# EAGLE design Board Jam v2 (EAGLE 6.6.0)
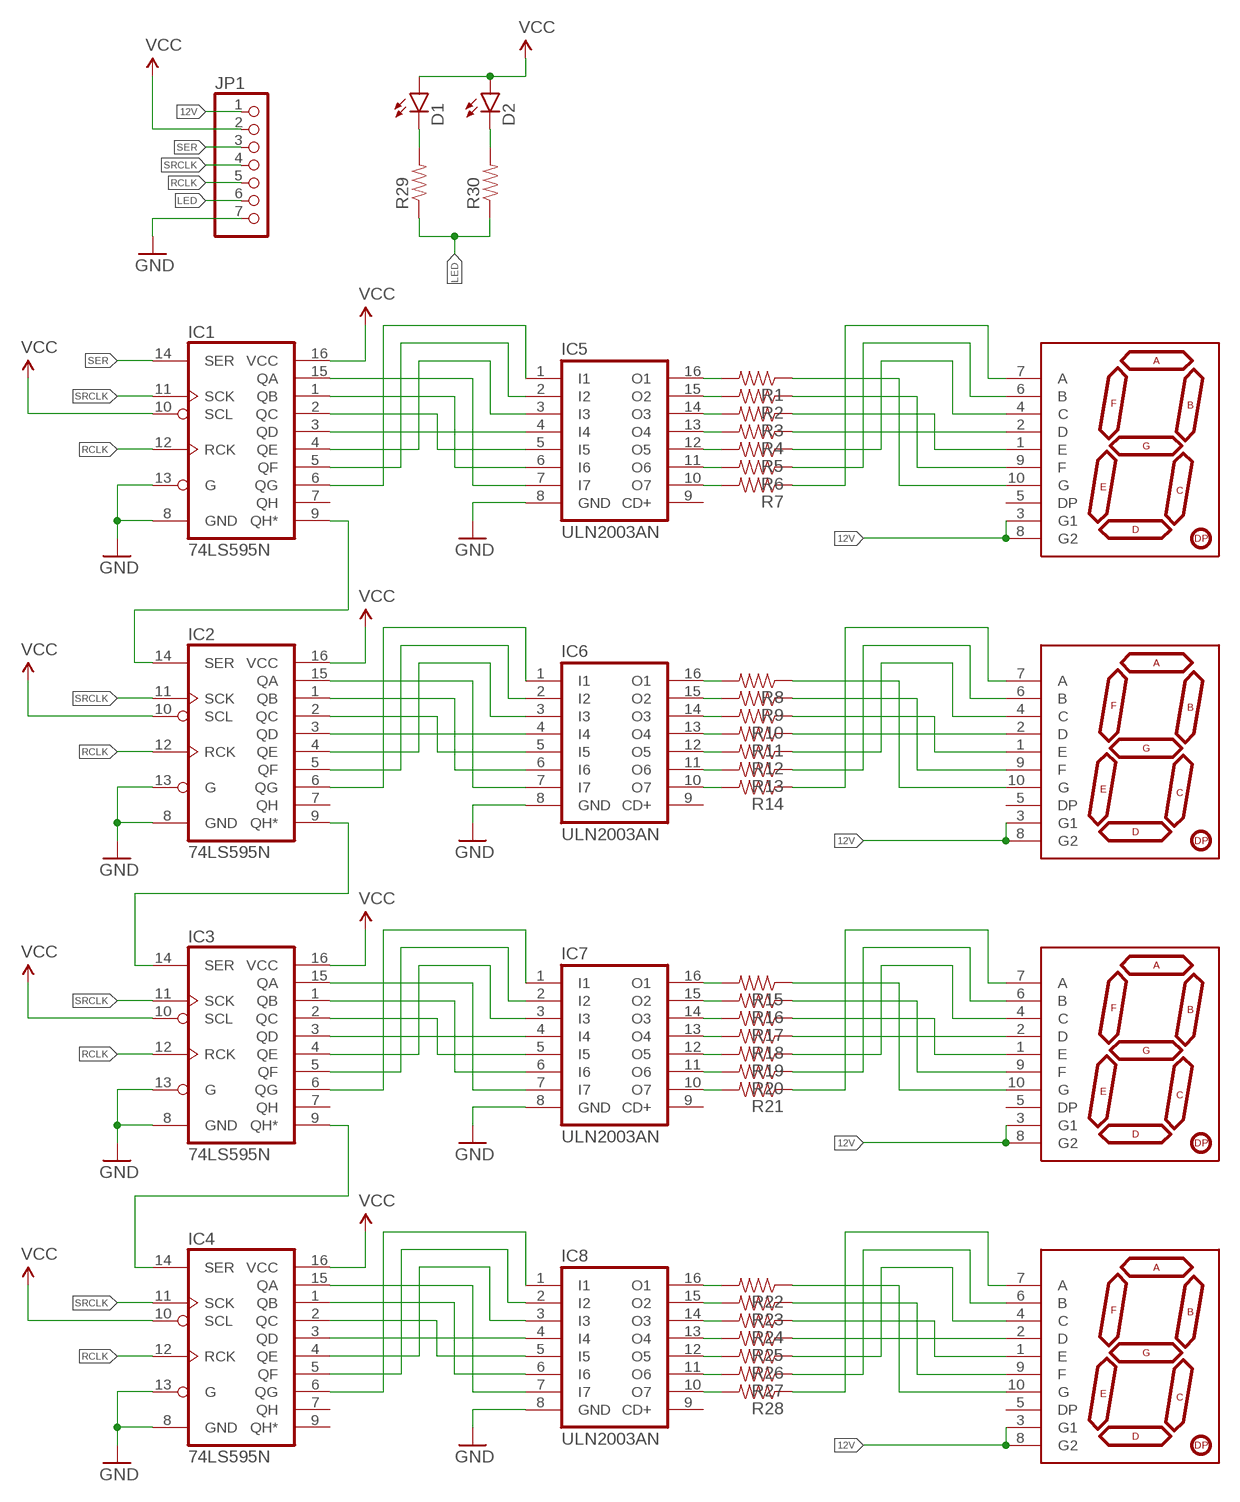
[diagram p0: schematic, sheet 1]

## Parts
D1  LED5MM  [LED5MM]
D2  LED5MM  [LED5MM]
IC1  74LS595N  [DIL16]
IC2  74LS595N  [DIL16]
IC3  74LS595N  [DIL16]
IC4  74LS595N  [DIL16]
IC5  ULN2003AN  [DIL16]
IC6  ULN2003AN  [DIL16]
IC7  ULN2003AN  [DIL16]
IC8  ULN2003AN  [DIL16]
JP1  PINHD-1X7  [1X07]
R1  RESISTORPTH-1/4W  [AXIAL-0.4]
R2  RESISTORPTH-1/4W  [AXIAL-0.4]
R3  RESISTORPTH-1/4W  [AXIAL-0.4]
R4  RESISTORPTH-1/4W  [AXIAL-0.4]
R5  RESISTORPTH-1/4W  [AXIAL-0.4]
R6  RESISTORPTH-1/4W  [AXIAL-0.4]
R7  RESISTORPTH-1/4W  [AXIAL-0.4]
R8  RESISTORPTH-1/4W  [AXIAL-0.4]
R9  RESISTORPTH-1/4W  [AXIAL-0.4]
R10  RESISTORPTH-1/4W  [AXIAL-0.4]
R11  RESISTORPTH-1/4W  [AXIAL-0.4]
R12  RESISTORPTH-1/4W  [AXIAL-0.4]
R13  RESISTORPTH-1/4W  [AXIAL-0.4]
R14  RESISTORPTH-1/4W  [AXIAL-0.4]
R15  RESISTORPTH-1/4W  [AXIAL-0.4]
R16  RESISTORPTH-1/4W  [AXIAL-0.4]
R17  RESISTORPTH-1/4W  [AXIAL-0.4]
R18  RESISTORPTH-1/4W  [AXIAL-0.4]
R19  RESISTORPTH-1/4W  [AXIAL-0.4]
R20  RESISTORPTH-1/4W  [AXIAL-0.4]
R21  RESISTORPTH-1/4W  [AXIAL-0.4]
R22  RESISTORPTH-1/4W  [AXIAL-0.4]
R23  RESISTORPTH-1/4W  [AXIAL-0.4]
R24  RESISTORPTH-1/4W  [AXIAL-0.4]
R25  RESISTORPTH-1/4W  [AXIAL-0.4]
R26  RESISTORPTH-1/4W  [AXIAL-0.4]
R27  RESISTORPTH-1/4W  [AXIAL-0.4]
R28  RESISTORPTH-1/4W  [AXIAL-0.4]
R29  RESISTORPTH-1/4W  [AXIAL-0.4]
R30  RESISTORPTH-1/4W  [AXIAL-0.4]
U$1  7-SEGMENT-DISPLAY-1"-RED7-SEGMENT-1.8"PTH  [7-SEGMENT-1"PTH]
U$2  7-SEGMENT-DISPLAY-1"-RED7-SEGMENT-1.8"PTH  [7-SEGMENT-1"PTH]
U$3  7-SEGMENT-DISPLAY-1"-RED7-SEGMENT-1.8"PTH  [7-SEGMENT-1"PTH]
U$4  7-SEGMENT-DISPLAY-1"-RED7-SEGMENT-1.8"PTH  [7-SEGMENT-1"PTH]

## Nets
12V: JP1.1 U$1.3(G1) U$1.8(G2) U$2.3(G1) U$2.8(G2) U$3.3(G1) U$3.8(G2) U$4.3(G1) U$4.8(G2)
GND: IC1.8(GND) IC1.13(G) IC2.8(GND) IC2.13(G) IC3.8(GND) IC3.13(G) IC4.8(GND) IC4.13(G) IC5.8(GND) IC6.8(GND) IC7.8(GND) IC8.8(GND) JP1.7
LED: JP1.6 R29.P$1 R30.P$1
N$1: IC1.15(QA) IC5.7(I7)
N$2: IC2.15(QA) IC6.7(I7)
N$3: IC1.1(QB) IC5.6(I6)
N$4: IC1.2(QC) IC5.5(I5)
N$5: IC1.3(QD) IC5.4(I4)
N$6: IC1.4(QE) IC5.3(I3)
N$7: IC1.5(QF) IC5.2(I2)
N$8: IC1.6(QG) IC5.1(I1)
N$9: IC2.1(QB) IC6.6(I6)
N$10: IC2.2(QC) IC6.5(I5)
N$11: IC2.3(QD) IC6.4(I4)
N$12: IC2.4(QE) IC6.3(I3)
N$13: IC2.5(QF) IC6.2(I2)
N$14: IC2.6(QG) IC6.1(I1)
N$15: IC6.16(O1) R8.P$2
N$16: IC6.15(O2) R9.P$2
N$17: IC6.14(O3) R10.P$2
N$18: IC6.13(O4) R11.P$2
N$19: IC6.12(O5) R12.P$2
N$20: IC6.11(O6) R13.P$2
N$21: IC6.10(O7) R14.P$2
N$22: IC3.15(QA) IC7.7(I7)
N$23: IC3.1(QB) IC7.6(I6)
N$24: IC3.2(QC) IC7.5(I5)
N$25: IC3.3(QD) IC7.4(I4)
N$26: IC3.4(QE) IC7.3(I3)
N$27: IC3.5(QF) IC7.2(I2)
N$28: IC3.6(QG) IC7.1(I1)
N$29: IC1.9(QH*) IC2.14(SER)
N$30: IC2.9(QH*) IC3.14(SER)
N$31: IC3.9(QH*) IC4.14(SER)
N$32: D1.K(C) R29.P$2
N$33: D2.K(C) R30.P$2
N$34: IC7.16(O1) R15.P$2
N$35: IC5.16(O1) R1.P$2
N$36: IC5.15(O2) R2.P$2
N$37: IC5.14(O3) R3.P$2
N$38: IC5.13(O4) R4.P$2
N$39: IC5.12(O5) R5.P$2
N$40: IC5.11(O6) R6.P$2
N$41: IC5.10(O7) R7.P$2
N$42: IC7.15(O2) R16.P$2
N$43: IC7.14(O3) R17.P$2
N$44: IC7.13(O4) R18.P$2
N$45: IC7.12(O5) R19.P$2
N$46: IC7.11(O6) R20.P$2
N$47: IC7.10(O7) R21.P$2
N$48: IC4.15(QA) IC8.7(I7)
N$49: IC4.1(QB) IC8.6(I6)
N$50: IC4.2(QC) IC8.5(I5)
N$51: IC4.3(QD) IC8.4(I4)
N$52: IC4.4(QE) IC8.3(I3)
N$53: IC4.5(QF) IC8.2(I2)
N$54: IC4.6(QG) IC8.1(I1)
N$55: IC8.16(O1) R22.P$2
N$56: IC8.15(O2) R23.P$2
N$57: IC8.14(O3) R24.P$2
N$58: IC8.13(O4) R25.P$2
N$59: IC8.12(O5) R26.P$2
N$60: IC8.11(O6) R27.P$2
N$61: IC8.10(O7) R28.P$2
N$62: R1.P$1 U$1.10(G)
N$63: R2.P$1 U$1.9(F)
N$64: R3.P$1 U$1.1(E)
N$65: R4.P$1 U$1.2(D)
N$66: R5.P$1 U$1.4(C)
N$67: R6.P$1 U$1.6(B)
N$68: R7.P$1 U$1.7(A)
N$69: R8.P$1 U$2.10(G)
N$70: R9.P$1 U$2.9(F)
N$71: R10.P$1 U$2.1(E)
N$72: R11.P$1 U$2.2(D)
N$73: R12.P$1 U$2.4(C)
N$74: R13.P$1 U$2.6(B)
N$75: R14.P$1 U$2.7(A)
N$76: R15.P$1 U$3.10(G)
N$77: R16.P$1 U$3.9(F)
N$78: R17.P$1 U$3.1(E)
N$79: R18.P$1 U$3.2(D)
N$80: R19.P$1 U$3.4(C)
N$81: R20.P$1 U$3.6(B)
N$82: R21.P$1 U$3.7(A)
N$83: R22.P$1 U$4.10(G)
N$84: R23.P$1 U$4.9(F)
N$85: R24.P$1 U$4.1(E)
N$86: R25.P$1 U$4.2(D)
N$87: R26.P$1 U$4.4(C)
N$88: R27.P$1 U$4.6(B)
N$89: R28.P$1 U$4.7(A)
RCLK: IC1.12(RCK) IC2.12(RCK) IC3.12(RCK) IC4.12(RCK) JP1.5
SER: IC1.14(SER) JP1.3
SRCLK: IC1.11(SCK) IC2.11(SCK) IC3.11(SCK) IC4.11(SCK) JP1.4
VCC: D1.A D2.A IC1.10(SCL) IC1.16(VCC) IC2.10(SCL) IC2.16(VCC) IC3.10(SCL) IC3.16(VCC) IC4.10(SCL) IC4.16(VCC) JP1.2
Unconnected: IC1.7(QH) IC2.7(QH) IC3.7(QH) IC4.7(QH) IC4.9(QH*) IC5.9(CD+) IC6.9(CD+) IC7.9(CD+) IC8.9(CD+) U$1.5(DP) U$2.5(DP) U$3.5(DP) U$4.5(DP)

## Library data of the parts
D1 D2 = SparkFun-LED:LED: LEDs Standard schematic elements and footprints for 5mm, 3mm, 1206, and 0603 sized LEDs. 5mm - Spark Fun Electronics SKU : COM-00529 (and others)
IC1-IC4 = SparkFun-DigitalIC:74*595: 8-bit SHIFT REGISTER, output latch
IC5-IC8 = uln-udn:ULN2003A: DRIVER ARRAY
JP1 = pinhead:PINHD-1X7: PIN HEADER
R1-R30 = SparkFun-Passives:RESISTOR: Resistor Basic schematic elements and footprints for 0603, 1206, and PTH resistors.
U$1-U$4 = yogaLibrary:7-SEGMENT-DISPLAY-1"-RED: 7-Segment Display 1" Red (COM-08546) EZ is for kits. Pads are only exposed on the bottom side to help prevent soldering in upside down.

## Board
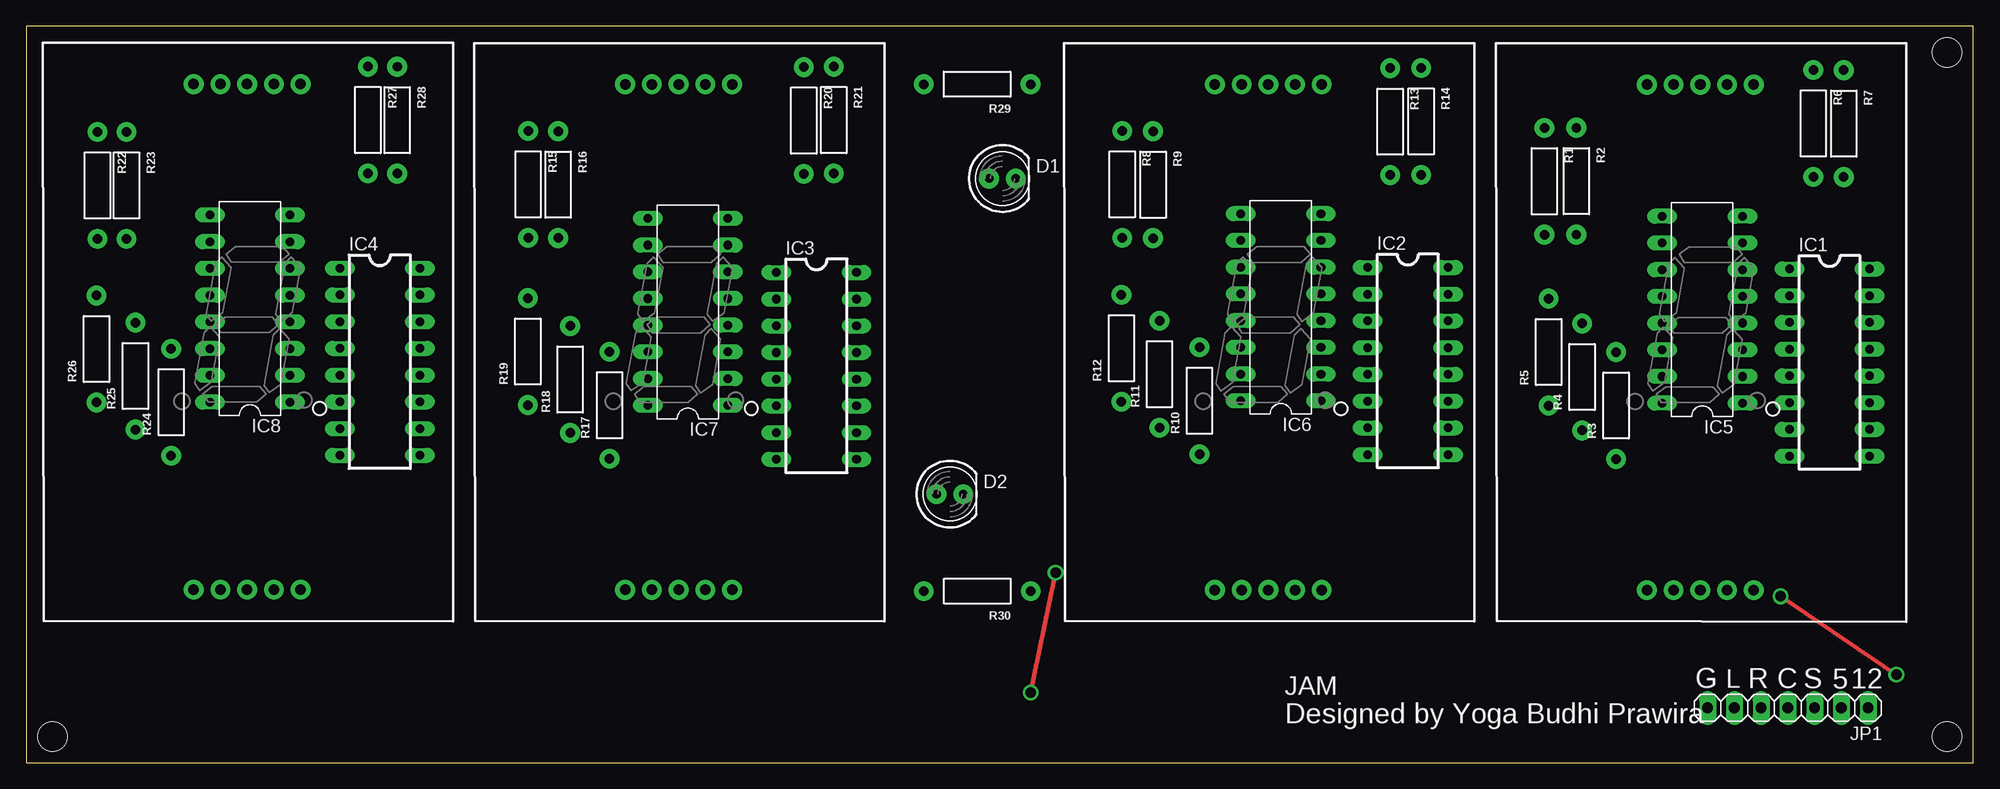
[diagram p1: board, top side]
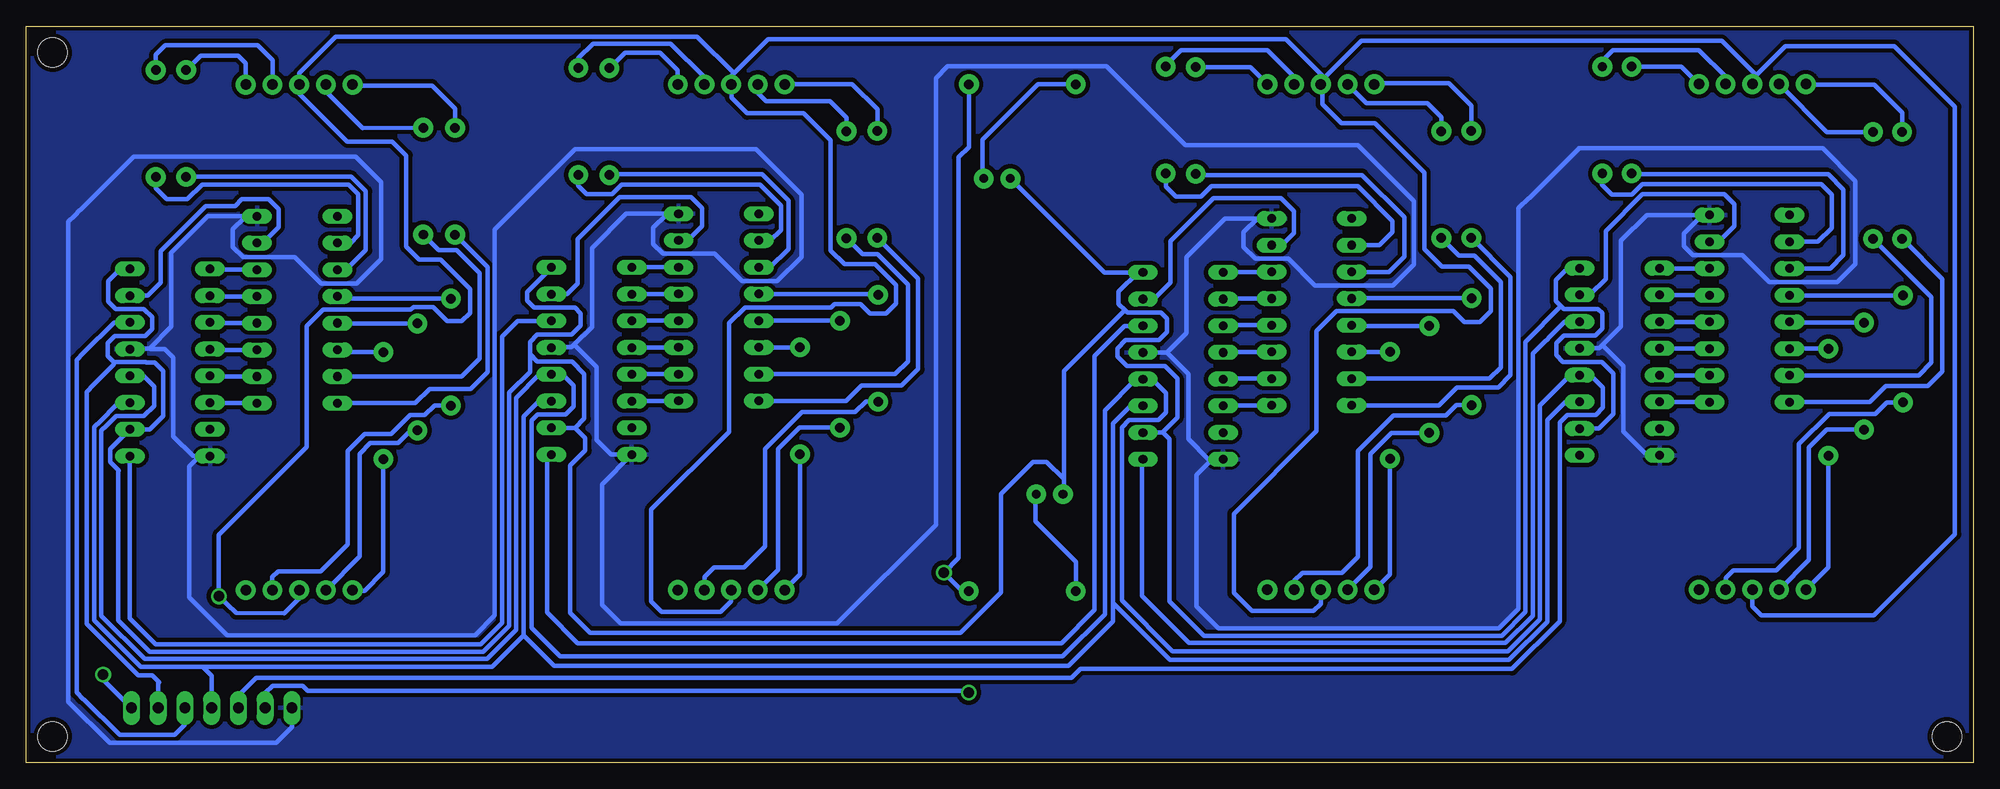
[diagram p2: board, bottom side, seen from below]

Size 185 x 70 mm. Coordinates in mm from the lower left corner, seen from the top.
Outline: 0,0 185,0 185,70 0,70 0,0
Copper layers (1*16): Top 0.035mm / dielectric 1.5mm / Bottom 0.035mm
Design rules "SparkFun": minimum track width 8mil, minimum drill 20mil, track to track 8mil, track to pad 8mil, pad to pad 8mil, via to via 8mil, smd to smd 8mil, copper to edge 8mil, drill to drill 8mil, minimum pad ring 12mil, minimum via ring 10mil, stop-mask expansion 4mil, vias tented up to drill 20mil, thermal gap 10mil
Holes 2.8 mm at 2.5,2.5 182.5,2.5 182.5,67.5

### Footprints (pad centres in the part's own frame; a part is rotated, then mirrored left to right if it is on the bottom)
LED5MM = drill 0.813 pad 1.88: A -1.27,0; K 1.27,0
DIL16 = drill 0.813 long: 1 -8.89,-3.81; 2 -6.35,-3.81; 3 -3.81,-3.81; 4 -1.27,-3.81; 5 1.27,-3.81; 6 3.81,-3.81; 7 6.35,-3.81; 8 8.89,-3.81; 9 8.89,3.81; 10 6.35,3.81; 11 3.81,3.81; 12 1.27,3.81; 13 -1.27,3.81; 14 -3.81,3.81; 15 -6.35,3.81; 16 -8.89,3.81
1X07 = drill 1.016 long: 1 -7.62,0; 2 -5.08,0; 3 -2.54,0; 4 0,0; 5 2.54,0; 6 5.08,0; 7 7.62,0
AXIAL-0.4 = drill 0.9 pad 1.88: P$1 -5.08,0; P$2 5.08,0
7-SEGMENT-1"PTH = drill 1 pad 1.88: 1 14.37,3.05; 2 16.91,3.05; 3 19.45,3.05; 4 21.99,3.05; 5 24.53,3.05; 6 24.53,51.11; 7 21.99,51.11; 8 19.45,51.11; 9 16.91,51.11; 10 14.37,51.11

### Placement (x,y rotation side)
D1  92.76,55.53 0 top
D2  87.76,25.53 0 top
IC1  171.35,38.04 270 top
IC2  131.28,38.18 270 top
IC3  75.08,37.72 270 top
IC4  33.59,38.11 270 top
IC5  159.26,43.06 90 top
IC6  119.21,43.29 90 top
IC7  62.86,42.85 90 top
IC8  21.25,43.17 90 top
JP1  167.39,5.21 180 top
R1  144.26,55.27 270 top
R2  147.29,55.28 270 top
R3  151.07,33.95 90 top
R4  147.83,36.67 90 top
R5  144.65,39.03 90 top
R6  169.81,60.77 270 top
R7  172.7,60.75 270 top
R8  104.13,54.97 270 top
R9  107.07,54.94 270 top
R10  111.48,34.41 90 top
R11  107.68,36.93 90 top
R12  104.06,39.4 90 top
R13  129.59,60.94 270 top
R14  132.54,60.96 270 top
R15  47.69,54.98 270 top
R16  50.54,54.95 270 top
R17  55.42,33.97 90 top
R18  51.68,36.43 90 top
R19  47.66,39.08 90 top
R20  73.87,61.04 270 top
R21  76.72,61.09 270 top
R22  6.76,54.88 270 top
R23  9.52,54.88 270 top
R24  13.76,34.27 90 top
R25  10.37,36.75 90 top
R26  6.66,39.33 90 top
R27  32.47,61.09 270 top
R28  35.24,61.08 270 top
R29  90.35,64.49 180 top
R30  90.36,16.3 180 top
U$1  139.62,13.35 0 top
U$2  98.57,13.37 0 top
U$3  42.54,13.38 0 top
U$4  1.53,13.39 0 top

### Tracks (layer width: path | path; a pad name or v marks a point on that pad's centre or on a via)
12V  (via drill 1)
  Top 0.406: v177.7,8.37 v166.7,15.82
  Bottom 0.406: U$4.3 20.98,14.86 20.12,14 9.45,14 1.73,21.72 1.73,62.34 7.52,68.13 17.85,68.13 20.63,65.35 | 20.63,65.35 20.96,65.02 20.96,64.52 U$4.8 | 61.65,65.11 61.99,64.77 U$3.8 61.85,64.35 61.85,62.58 60.04,60.77 56.85,60.77 52.17,56.09 52.17,48.83 50.49,47.15 47.91,47.15 45.83,45.07 45.83,42.92 46.87,41.88 48.33,41.88 49.39,42.94 60.5,42.94 62.39,41.05 62.39,31.52 70.25,23.66 70.25,16.14 68.52,14.41 62.68,14.41 61.99,15.1 U$3.3 | 61.65,65.11 58.15,68.61 23.89,68.61 20.63,65.35 | 117.77,65.52 118.02,65.27 U$2.8 118,64.46 118,63.23 116.5,61.73 111.15,61.73 108.58,59.16 108.58,48.69 107.27,47.38 104.34,47.38 102.35,45.39 102.35,43.64 103.06,42.93 103.07,42.93 103.3,42.7 104.82,42.7 105.74,43.62 108.18,43.62 108.52,43.28 116.72,43.28 118.23,41.77 118.23,31.46 125.61,24.08 125.61,15.32 124.63,14.34 119.01,14.34 118.02,15.33 U$2.3 | 117.77,65.52 114.51,68.78 65.32,68.78 61.65,65.11 | 117.77,65.52 121.27,69.02 155.58,69.02 159.07,65.53 U$1.8 159.05,64.44 159.05,63.6 154.5,59.05 150.22,59.05 148.89,57.72 148.89,49.04 147.68,47.83 145.63,47.83 142.81,45.01 142.81,42.76 143.61,41.96 144.99,41.96 146.36,43.33 148.21,43.33 148.48,43.06 156.81,43.06 158.38,41.49 158.38,29.99 166.7,21.67 v166.7,15.82 165.06,14.24 160.49,14.19 159.1,15.58 159.07,15.58 U$1.3 | v177.7,8.37 177.77,8.32 177.77,7.97 JP1.1
GND
  Bottom 0.406: 132.93,39.74 131.25,41.42 131.25,48.93 128,52.18 124.34,52.18 124.23,52.07 | 132.93,39.74 133.17,39.5 135.04,39.5 IC2.13 | 132.93,39.74 130.81,37.62 130.81,30.68 129.42,29.29 IC2.8 130.3,26.46 130.3,14.99 128.55,13.24 107.96,13.24 98.58,22.62 98.58,65.08 97.46,66.2 82.36,66.2 74.86,58.7 58.45,58.7 53.13,53.38 53.13,47.35 55.12,45.36 62.55,45.36 65.09,47.9 68.21,47.9 69.33,49.02 69.33,50.44 68.03,51.74 | 173.28,39.38 171.22,41.44 171.22,48.48 167.75,51.95 164.45,51.95 164.29,51.79 | 173.28,39.38 173.31,39.35 175.12,39.35 IC1.13 | IC1.8 168.52,29.15 | 168.52,29.15 169.16,29.15 171.02,31.01 171.02,38.53 171.83,39.34 173.24,39.34 173.28,39.38 | 35.22,39.72 33.46,41.48 33.46,49.63 31.03,52.06 25.72,52.06 | 35.22,39.72 35.52,39.42 37.36,39.42 IC4.13 | IC4.8 30.95,29.22 33.23,31.5 33.23,37.73 35.22,39.72 | IC7.8 68.03,51.74 | 68.03,51.74 71.09,51.74 74.76,48.07 74.76,40.83 76.62,38.97 | 76.62,38.97 78.87,38.97 IC3.13 | IC3.8 72.32,28.83 | 72.32,28.83 72.66,28.83 74.58,30.75 74.58,36.93 76.62,38.97 | IC8.8 25.72,52.06 | 25.72,52.06 27.51,50.27 27.51,49.11 26.65,48.25 21.92,48.25 19.37,45.7 12.9,45.7 11.21,47.39 11.21,55.3 14.31,58.4 37.46,58.4 37.46,58.39 42.18,53.67 42.24,53.67 43.21,52.7 43.21,14.62 45.08,12.75 71.73,12.75 73.82,14.84 73.82,27.33 72.32,28.83 | IC6.8 124.12,52.18 124.23,52.07 | 124.23,52.07 125.45,50.85 125.45,49.32 124.51,48.38 119.61,48.38 117,45.77 113.64,45.77 111.34,48.07 111.34,53.99 115.65,58.3 132.85,58.3 140.25,50.9 140.25,50.89 140.48,50.66 140.48,14.01 142.37,12.12 165.92,12.12 169.5,15.7 169.5,28.17 168.52,29.15
  Bottom 0.406: IC5.8 164.13,51.95 164.29,51.79 | 164.29,51.79 165.38,50.7 165.38,49.03 164.41,48.06 159.49,48.06 156.96,45.53 153.61,45.53 151.28,47.86 151.28,55.21 153.7,57.63 174.77,57.63 179.88,52.52 179.9,52.52 180.4,52.02 180.41,52.02 181,51.43 181,5.81 177.08,1.89 161.28,1.89 159.76,3.41 JP1.7
  pour Bottom (isolate 0.406): 0,70 184.37,70 arc-90 185,69.36 185,0 0.64,0 arc-90 0,0.64
LED  (via drill 1)
  Top 0.406: v95.44,6.66 v97.81,18.06
  Bottom 0.406: R29.P$1 95.43,58.53 96.42,57.54 96.42,19.45 v97.81,18.06 96.05,16.3 R30.P$1 | v95.44,6.66 95.58,6.85 158.28,6.85 158.76,7.33 161.59,7.33 162.28,6.64 162.28,5.24 JP1.6
N$1
  Bottom 0.406: IC5.7 162.54,49.41 161.02,50.93 161.02,52.6 161.97,53.55 164.53,53.55 165.17,52.91 167.94,52.91 172.22,48.63 172.22,45.65 173.47,44.4 IC1.15
N$2
  Bottom 0.406: IC6.7 122.16,49.64 120.77,51.03 120.77,52.71 121.84,53.78 128.63,53.78 132.62,49.79 132.62,45.54 133.62,44.54 IC2.15
N$3
  Bottom 0.406: IC5.6 167.48,46.87 IC1.1
N$4
  Bottom 0.406: IC5.5 167.48,44.33 IC1.2
N$5
  Bottom 0.406: IC5.4 167.48,41.79 IC1.3
N$6
  Bottom 0.406: IC5.3 167.48,39.25 IC1.4
N$7
  Bottom 0.406: IC5.2 167.48,36.71 IC1.5
N$8
  Bottom 0.406: IC5.1 167.48,34.17 IC1.6
N$9
  Bottom 0.406: IC6.6 127.44,47.1 IC2.1
N$10
  Bottom 0.406: IC6.5 127.44,44.56 IC2.2
N$11
  Bottom 0.406: IC6.4 127.44,42.02 IC2.3
N$12
  Bottom 0.406: IC6.3 127.44,39.48 IC2.4
N$13
  Bottom 0.406: IC6.2 127.44,36.94 IC2.5
N$14
  Bottom 0.406: IC6.1 127.44,34.4 IC2.6
N$15
  Bottom 0.406: IC6.16 107.09,34.4 105.65,35.84 101.82,35.84 100.25,37.41 100.25,46.01 R8.P$2
N$16
  Bottom 0.406: IC6.15 102.44,36.94 101.23,38.15 101.23,45.45 104.11,48.33 105.54,48.33 R9.P$2
N$17
  Bottom 0.406: IC6.14 R10.P$2
N$18
  Bottom 0.406: IC6.13 R11.P$2
N$19
  Bottom 0.406: IC6.12 104.14,44.56 R12.P$2
N$20
  Bottom 0.406: R13.P$2 129.52,55.93 115.1,55.93 112.59,53.42 112.59,48.83 114.36,47.06 115.36,47.06 IC6.11
N$21
  Bottom 0.406: R14.P$2 132.55,54.84 131.78,54.07 129.33,54.07 128.43,54.97 115.29,54.97 113.29,52.97 113.29,50.65 114.31,49.63 IC6.10
N$22
  Bottom 0.406: IC7.7 65.69,49.2 64.54,50.35 64.54,52.41 65.79,53.66 72.19,53.66 76.28,49.57 76.28,45.64 77.85,44.07 IC3.15
N$23
  Bottom 0.406: IC7.6 71.22,46.66 IC3.1
N$24
  Bottom 0.406: IC7.5 71.22,44.12 IC3.2
N$25
  Bottom 0.406: IC7.4 71.22,41.58 IC3.3
N$26
  Bottom 0.406: IC7.3 71.22,39.04 IC3.4
N$27
  Bottom 0.406: IC7.2 71.22,36.5 IC3.5
N$28
  Bottom 0.406: IC7.1 71.22,33.96 IC3.6
N$29
  Bottom 0.406: IC2.14 138.33,41.99 139.79,40.53 139.79,13.27 141.83,11.23 172.69,11.23 175.16,13.7 IC1.9
N$30
  Bottom 0.406: IC3.14 80.64,41.53 83.5,38.67 83.5,14.51 86.65,11.36 132.62,11.36 135.53,14.27 135.53,28.85 IC2.9
N$31
  Bottom 0.406: IC4.14 38.78,41.92 40.35,40.35 40.35,40.33 40.55,40.13 40.61,40.13 41.86,38.88 41.86,13.97 44.45,11.38 74.51,11.38 78.97,15.84 78.97,28.75 IC3.9 79.01,28.71
N$32
  Bottom 0.406: R29.P$2 88.88,64.49 94.14,59.23 94.14,55.64 D1.K
N$33
  Bottom 0.406: R30.P$2 85.28,19.1 89.12,22.94 89.12,25.44 D2.K
N$34
  Bottom 0.406: IC7.16 50.78,33.96 49.06,35.68 45.13,35.68 43.96,36.85 43.96,46.17 R15.P$2
N$35
  Bottom 0.406: IC5.16 148.04,34.17 146.67,35.54 142.77,35.54 141.18,37.13 141.18,47.11 R1.P$2
N$36
  Bottom 0.406: IC5.15 143.61,36.71 141.92,38.4 141.92,46.53 144.13,48.74 145.83,48.74 R2.P$2
N$37
  Bottom 0.406: R3.P$2 155.23,39.03 IC5.14
N$38
  Bottom 0.406: R4.P$2 155.41,41.75 IC5.13
N$39
  Bottom 0.406: R5.P$2 155.23,44.11 IC5.12
N$40
  Bottom 0.406: R6.P$2 154.13,55.69 152.75,54.31 152.75,48.71 154.59,46.87 IC5.11
N$41
  Bottom 0.406: R7.P$2 172.71,54.61 171.66,53.56 169.69,53.56 168.28,54.97 154.38,54.97 153.45,54.04 153.45,50.16 154.2,49.41 IC5.10
N$42
  Bottom 0.406: IC7.15 45.98,36.5 44.9,37.58 44.9,45.7 47.41,48.21 48.88,48.21 R16.P$2
N$43
  Bottom 0.406: R17.P$2 IC7.14
N$44
  Bottom 0.406: R18.P$2 58.98,41.51 IC7.13
N$45
  Bottom 0.406: R19.P$2 59.01,44.16 IC7.12
N$46
  Bottom 0.406: IC7.11 55.54,46.66 54.07,48.13 54.07,51.86 58.08,55.87 73.78,55.87 R20.P$2
N$47
  Bottom 0.406: IC7.10 56.41,49.2 55.18,50.43 55.18,51.5 58.48,54.8 72.4,54.8 73.4,53.8 75.77,53.8 76.72,54.75 R21.P$2
N$48
  Bottom 0.406: IC8.7 24.18,49.52 22.68,51.02 22.68,53.08 23.64,54.04 31.42,54.04 34.93,50.53 34.93,45.97 36.41,44.49 37.37,44.49 IC4.15
N$49
  Bottom 0.406: IC8.6 29.76,46.98 IC4.1
N$50
  Bottom 0.406: IC8.5 29.76,44.44 IC4.2
N$51
  Bottom 0.406: IC8.4 29.76,41.9 IC4.3
N$52
  Bottom 0.406: IC8.3 29.76,39.36 IC4.4
N$53
  Bottom 0.406: IC8.2 29.76,36.82 IC4.5
N$54
  Bottom 0.406: IC8.1 29.76,34.28 IC4.6
N$55
  Bottom 0.406: IC8.16 9.81,34.28 8.29,35.8 4.3,35.8 2.93,37.17 2.93,45.97 R22.P$2
N$56
  Bottom 0.406: IC8.15 5.19,36.82 3.98,38.03 3.98,44.26 R23.P$2
N$57
  Bottom 0.406: IC8.14 R24.P$2
N$58
  Bottom 0.406: R25.P$2 17.37,41.83 IC8.13
N$59
  Bottom 0.406: R26.P$2 17.41,44.41 IC8.12
N$60
  Bottom 0.406: IC8.11 13.59,46.98 12.34,48.23 12.34,54.49 13.78,55.93 32.39,55.93 R27.P$2
N$61
  Bottom 0.406: IC8.10 14.75,49.52 13.44,50.83 13.44,54 14.44,55 31.45,55 32.44,54.01 34.33,54.01 35.28,54.96 35.28,55.96 R28.P$2
N$62
  Bottom 0.406: R1.P$1 144.26,62.18 146.44,64.36 153.89,64.36 U$1.10
N$63
  Bottom 0.406: R2.P$1 153.03,60.33 156.58,63.88 156.58,64.41 U$1.9
N$64
  Bottom 0.406: R3.P$1 151.07,18.12 152.84,16.35 153.94,16.35 U$1.1
N$65
  Bottom 0.406: R4.P$1 148.46,31.59 149.66,30.39 152.32,30.39 153.34,29.37 153.34,19.59 U$1.2
N$66
  Bottom 0.406: R5.P$1 146.22,33.95 147.14,33.03 148.54,33.03 150.31,31.26 152.85,31.26 154.47,29.64 154.47,20.75 157.02,18.2 161.07,18.2 161.63,17.64 161.63,16.42 U$1.4
N$67
  Bottom 0.406: U$1.6 164.15,66.48 164.88,67.21 168.45,67.21 R6.P$1
N$68
  Bottom 0.406: U$1.7 161.61,66.78 163.03,68.2 171.79,68.2 172.71,67.28 R7.P$1
N$69
  Bottom 0.406: R8.P$1 104.13,62.11 106.54,64.52 112.9,64.52 U$2.10
N$70
  Bottom 0.406: 115.45,64.45 U$2.9 115.53,64.43 115.53,63.7 114.73,62.9 108.65,62.9 107.07,61.32 R9.P$1
N$71
  Bottom 0.406: R10.P$1 111.48,17.88 U$2.1
N$72
  Bottom 0.406: R11.P$1 111.53,31.85 113.55,29.83 113.55,18.35 U$2.2
N$73
  Bottom 0.406: R12.P$1 105.23,34.32 106.23,33.32 111.29,33.32 114.79,29.82 114.79,20.55 116.78,18.56 119.66,18.56 120.56,17.66 U$2.4
N$74
  Bottom 0.406: U$2.6 123.1,65.81 124.8,67.51 128.1,67.51 R13.P$1
N$75
  Bottom 0.406: U$2.7 120.56,65.14 123.78,68.36 131.14,68.36 132.55,66.95 R14.P$1
N$76
  Bottom 0.406: R15.P$1 47.69,62.46 49.82,64.59 56.81,64.59 U$3.10
N$77
  Bottom 0.406: R16.P$1 50.54,61.37 51.88,62.71 57.67,62.71 U$3.9
N$78
  Bottom 0.406: R17.P$1 55.42,17.92 U$3.1
N$79
  Bottom 0.406: R18.P$1 55.29,31.35 57.28,29.36 57.28,18.6 U$3.2
N$80
  Bottom 0.406: R19.P$1 49.1,34 50.1,33 55.11,33 58.49,29.62 58.49,19.55 59.98,18.06 63.76,18.06 64.56,17.26 64.56,16.46 U$3.4
N$81
  Bottom 0.406: R20.P$1 68.7,66.12 U$3.6
N$82
  Bottom 0.406: R21.P$1 76.72,66.3 75.3,67.72 67.08,67.72 64.51,65.15 64.51,64.51 U$3.7
N$83
  Bottom 0.406: R22.P$1 6.76,61.81 9.41,64.46 15.86,64.46 U$4.10
N$84
  Bottom 0.406: R23.P$1 13.9,59.96 U$4.9
N$85
  Bottom 0.406: R24.P$1 13.76,18.58 U$4.1
N$86
  Bottom 0.406: R25.P$1 13.9,31.67 15.61,29.96 15.61,19.27 U$4.2
N$87
  Bottom 0.406: R26.P$1 8.23,34.25 9.32,33.16 13.69,33.16 16.56,30.29 16.56,20.41 18.71,18.26 22.8,18.26 23.5,17.56 23.5,16.46 U$4.4
N$88
  Bottom 0.406: R27.P$1 27.73,66.17 U$4.6
N$89
  Bottom 0.406: R28.P$1 35.24,66.74 34.24,67.74 26.05,67.74 23.48,65.17 23.48,64.54 U$4.7
RCLK
  Bottom 0.406: IC1.12 173.85,36.77 172.86,35.78 172.86,33.93 173.85,32.94 176.48,32.94 177.55,31.87 177.55,31.86 177.61,31.8 177.63,31.8 177.86,31.57 177.86,13.98 173.74,9.86 141.23,9.86 138.48,12.61 138.48,34.69 136.26,36.91 IC2.12 134.06,36.91 132.99,35.84 132.99,33.86 133.76,33.09 136.42,33.09 137,32.51 137,12.81 134.28,10.09 86.54,10.09 82.52,14.11 82.52,33.48 79.54,36.46 IC3.12 78.03,36.46 76.69,35.12 76.69,33.31 77.41,32.59 80.2,32.59 80.91,31.88 80.91,15.44 76.07,10.6 44.23,10.6 41.19,13.64 41.19,33.95 38.3,36.84 IC4.12 37.38,36.82 36.34,36.82 35.17,35.65 35.17,33.78 35.88,33.07 38.58,33.07 39.3,32.35 39.3,13.45 43.83,8.92 84.83,8.92 85.67,8.08 163.14,8.08 164.85,6.37 JP1.5
SER
  Bottom 0.406: IC1.14 176.66,41.85 179.58,38.93 179.58,38.92 180.21,38.29 180.21,6.67 179.58,6.04 179.53,6.04 176.12,2.63 170.89,2.63 169.93,3.59 JP1.3
SRCLK
  Bottom 0.406: IC4.11 38.76,34.3 39.13,33.93 39.13,33.92 40.47,32.58 40.47,13.39 44.1,9.76 76.35,9.76 81.76,15.17 | IC3.11 78.92,33.88 80.11,33.88 81.76,32.23 81.76,15.17 | IC2.11 136.28,34.37 137.73,32.92 137.73,12.1 | 137.73,12.1 134.86,9.23 85.98,9.23 81.76,13.45 81.76,15.17 | IC1.11 176.2,34.23 178.21,32.22 178.24,32.22 178.56,31.9 178.56,13.53 174.14,9.11 168.22,9.11 | 137.73,12.1 139.24,10.59 139.25,10.59 140.73,9.11 168.22,9.11 | JP1.4 167.39,8.28 168.22,9.11
VCC
  Bottom 0.406: 176.7,38.09 173.64,38.09 173.59,38.04 172.81,38.04 172,37.23 172,32.95 173.26,31.69 IC1.10 177.02,29.83 177.02,28.57 176.23,27.78 176.23,27.71 176.25,27.69 176.25,13.53 173.28,10.56 141.58,10.56 139.13,13.01 139.13,35.17 137.15,37.15 137.15,38.85 | 176.7,38.09 177.27,38.66 177.27,39.9 176.59,40.58 173.68,40.58 173.05,41.21 173.05,42.34 173.84,43.13 176.49,43.13 177.2,43.84 177.2,45.8 176.09,46.91 175.18,46.91 IC1.16 | IC2.10 132.86,31.83 | 132.86,31.83 131.98,32.71 131.98,36.97 133.16,38.15 136.45,38.15 137.15,38.85 | 137.15,38.85 137.15,40 136.47,40.68 133.18,40.68 132.32,41.54 132.32,42.71 132.86,43.25 136.74,43.25 137.42,43.93 137.42,44.74 IC2.16 | 132.86,31.83 131.9,30.87 131.9,29.67 133.32,28.25 133.32,14.22 131.42,12.32 96.23,12.32 92.37,16.18 92.37,25.56 89.32,28.61 88.07,28.61 86.42,26.96 | 176.7,38.09 176.7,37.84 178.93,35.61 178.93,35.56 179.26,35.23 179.26,13.22 174.35,8.31 173.02,8.31 172.37,7.66 172.47,7.56 JP1.2 | D1.A 82.57,46.61 IC3.16 79.39,46.61 81.2,44.8 81.2,43.6 80.62,43.02 | 86.42,26.96 86.42,25.6 D2.A | 80.62,43.02 80.37,42.77 77.16,42.77 76.63,42.24 76.63,40.92 77.38,40.17 80.55,40.17 81.33,39.39 81.33,38.62 80.4,37.69 76.8,37.69 75.62,36.51 75.62,32.8 77,31.42 77,31.39 | 77,31.39 78.87,31.39 IC3.10 | 86.42,26.96 86.42,37.23 80.62,43.02 | IC4.16 38.51,47 39.64,45.87 39.64,43.87 39.16,43.4 | 39.16,43.4 38.91,43.14 35.66,43.14 35.26,42.74 35.26,41.25 35.9,40.61 38.91,40.61 39.63,39.89 39.63,38.75 38.98,38.1 35.31,38.1 34.21,37 34.21,33.14 35.59,31.76 IC4.10 | 77,31.39 76.36,30.75 76.36,15.34 73.1,12.08 44.8,12.08 42.55,14.33 42.55,40.01 39.16,43.4

### Text on the board
tNames: G | L | R | C | S | 5 | 12 | JAM | Designed by Yoga Budhi Prawira